# Altium schematic sheet Sheet3.SchDoc
size A
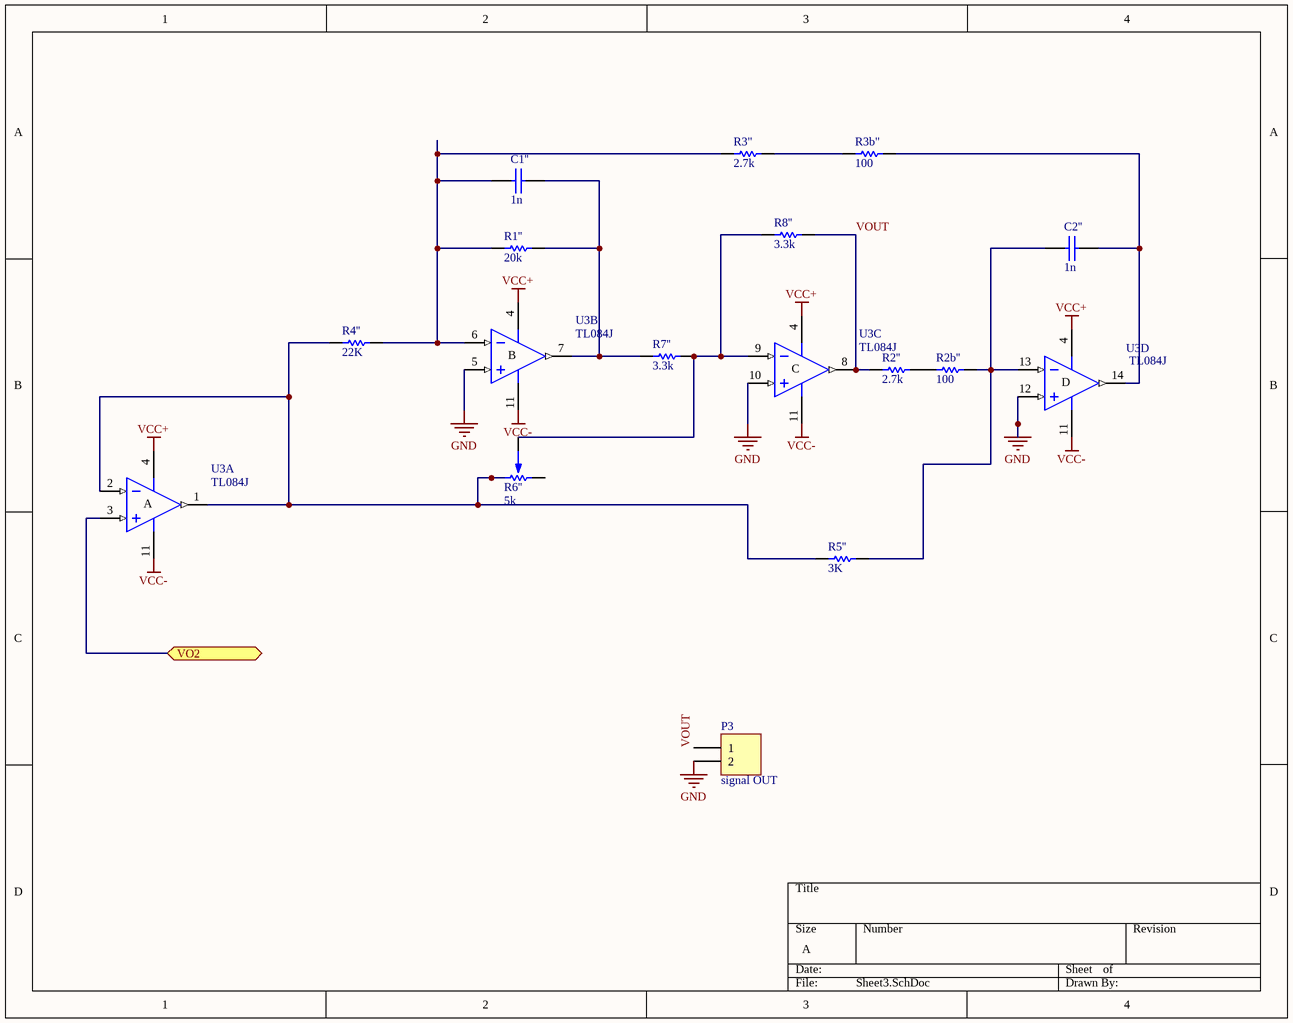
[diagram p0: Sheet3.SchDoc]

## Parts
C1''  1n  [CAP100]
C2''  1n  [CAP100]
P3  signal OUT  [HDR1X2]
R1''  20k  [0805]
R2''  2.7k  [0805]
R2b''  100  [0805]
R3"  2.7k  [0805]
R3b"  100  [0805]
R4''  22K  [0805]
R5''  3K  [0805]
R6''  5k  [PRESET V]
R7''  3.3k  [0805]
R8''  3.3k  [0805]
U3  TL084J  [J014]  (parts A,B,C,D of 4)

## Ports
VO2 (bidir)

## Nets
GND: P3.2 U3.5(IN+) U3.10(IN+) U3.12(IN+)
VCC+: U3.4(V+)
VCC-: U3.11(V-)
VO2: U3.3(IN+) ; port VO2
VOUT: P3.1 R2''.1 R8''.2 U3.8(OUT)
NetC1''_1: C1''.1 R1''.1 R3".1 R4''.2 U3.6(IN-)
NetC1''_2: C1''.2 R1''.2 R7''.1 U3.7(OUT)
NetC2''_1: C2''.1 R2b''.2 R5''.2 U3.13(IN-)
NetC2''_2: C2''.2 R3b".2 U3.14(OUT)
NetR2''_2: R2''.2 R2b''.1
NetR3"_2: R3".2 R3b".1
NetR4''_1: R4''.1 R5''.1 R6''.1 U3.1(OUT) U3.2(IN-)
NetR6''_2: R6''.2 R7''.2 R8''.1 U3.9(IN-)

Not connected (* = marked no-connect by the designer): R6'' 3

## Notes on the sheet
- (in symbol TL084J, part A) A
- (in symbol TL084J, part B) B
- (in symbol TL084J, part C) C
- (in symbol TL084J, part D) D

## Library data of the parts
C1'' C2'' = CAP
P3 = Header 2: Header, 2-Pin; LatestRevisionDate: 17-Jul-2002; LatestRevisionNote: Re-released for DXP Platform.; Publisher: Altium Limited
R1'' R2'' R2b'' R3" R3b" R4'' R5'' R7'' R8'' = RES
R6'' = PRESET
U3 = TL084J: JFET-Input Operational Amplifier; Published: 16-Jan-2001; LatestRevisionDate: 04-Mar-2005; LatestRevisionNote: Stylized 3D Model Added.; DatasheetVersion: Feb-1999; PackageVersion: Jun-1999; PackageReference: J014; Publisher: Altium Limited; PackageDescription: DIP; 14 Leads; Row Spacing 7.62 mm; Pitch 2.54 mm; ComponentLink1Description: Manufacturer Link; ComponentLink1URL: http://www.ti.com/; ComponentLink2Description: Datasheet; ComponentLink2URL: http://www-s.ti.com/sc/ds/tl084.pdf